# Altium schematic sheet Sheet5.SchDoc
size A3; Author: Manik Trehan; Engineer: Manik Trehan; Organization: Mountz Inc.; Address1: 1080 N 11th ST; Address2: San Jose, CA - 95112; Revision: 1.0
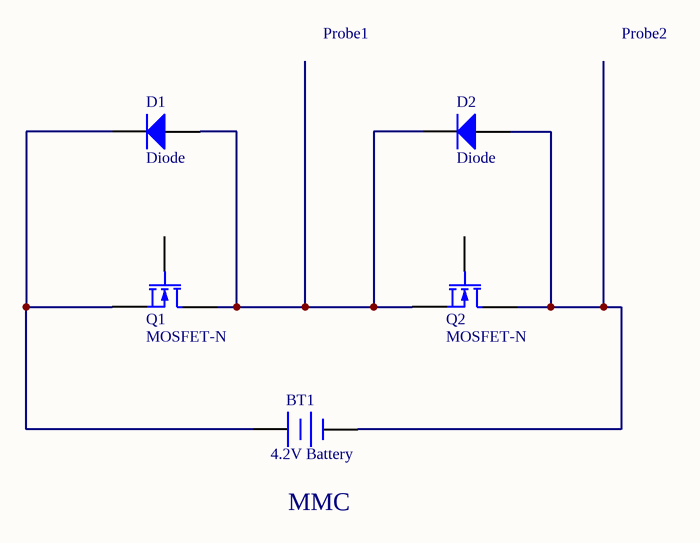
[diagram p0: Sheet5.SchDoc]

## Parts
BT1  4.2V Battery  [BAT-2]
D1  Diode  [SMC]
D2  Diode  [SMC]
Q1  MOSFET-N  [E3]
Q2  MOSFET-N  [E3]

## Nets
NetBT1_1: BT1.1(+) D1.2(K) Q1.3(S)
NetBT1_2: BT1.2(-) D2.1(A) Q2.1(D)
NetD1_1: D1.1(A) D2.2(K) Q1.1(D) Q2.3(S)

Not connected (* = marked no-connect by the designer): Q1 2(G); Q2 2(G)

## Notes on the sheet
- Probe1
- Probe2
- (near BT1) MMC
- Title
- Size:
- Date:
- A3
- Number:
- Time:
- Revision:
- Sheet
- of
- Author:
- File:

## Library data of the parts
BT1 = Battery: Multicell Battery; Published: 24-Mar-1999; LatestRevisionDate: 17-Jul-2002; LatestRevisionNote: Re-released for DXP Platform.; PackageReference: BAT-2; Publisher: Altium Limited; PackageDescription: Battery; 2 Leads
D1 D2 = Diode: Default Diode; Published: 8-Jun-2000; LatestRevisionDate: 17-Jul-2002; LatestRevisionNote: Re-released for DXP Platform.; PackageVersion: Sep-1996; PackageReference: SMC; Publisher: Altium Limited; PackageDescription: DO-214-AB/SMC; 2 C-Bend Leads; Body 7.9 x 5.9 mm, inc. leads (LxW); Code_JEDEC: DO-214-AB
Q1 Q2 = MOSFET-N: N-Channel MOSFET; Published: 8-Jun-2000; LatestRevisionDate: 17-Jul-2002; LatestRevisionNote: Re-released for DXP Platform.; PackageVersion: 1995/1996; PackageReference: E3; Publisher: Altium Limited; PackageDescription: TO, Flat Index; 3 In-Line, Axial Leads; Body Dia. 4.6mm; Lead Dia. 0.5 mm (max)